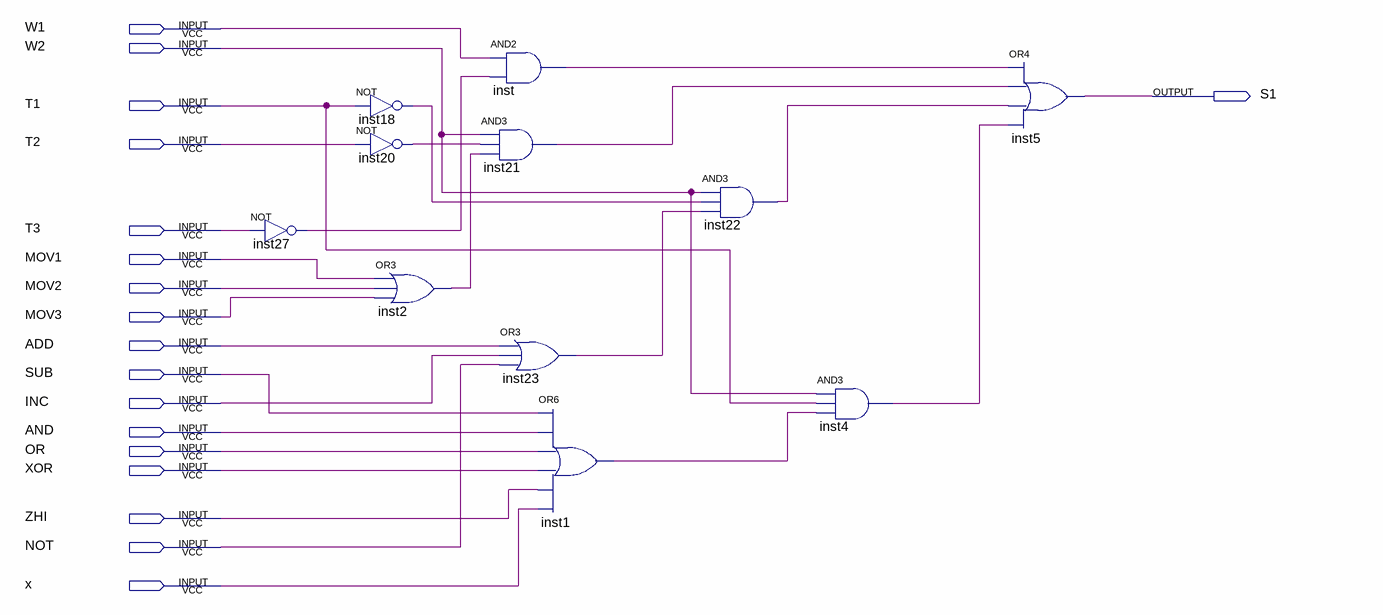
[diagram p0: schematic sheet]
// Quartus schematic S1.bdf as structural Verilog: 11 symbols, 18 pins
module S1 (
  input  W1,
  input  W2,
  input  T1,
  input  T2,
  input  T3,
  input  MOV1,
  input  MOV2,
  input  MOV3,
  input  ADD,
  input  SUB,
  input  INC,
  input  AND,
  input  OR,
  input  XOR,
  input  ZHI,
  input  NOT,
  input  x,
  output S1
);

  wire inst1_out, inst2_out, inst4_out, inst18_out, inst20_out, inst21_out, inst22_out, inst23_out,
       inst27_out, inst_out;

  not inst27 (inst27_out, T3);
  not inst18 (inst18_out, T1);
  not inst20 (inst20_out, T2);
  or inst2 (inst2_out, MOV1, MOV2, MOV3);
  and inst (inst_out, W1, inst27_out);
  and inst21 (inst21_out, W2, inst20_out, inst2_out);
  or inst23 (inst23_out, ADD, INC, NOT);
  or inst1 (inst1_out, SUB, AND, OR, XOR, ZHI, x);
  and inst22 (inst22_out, W2, inst18_out, inst23_out);
  and inst4 (inst4_out, W2, T1, inst1_out);
  or inst5 (S1, inst_out, inst21_out, inst22_out, inst4_out);
endmodule
